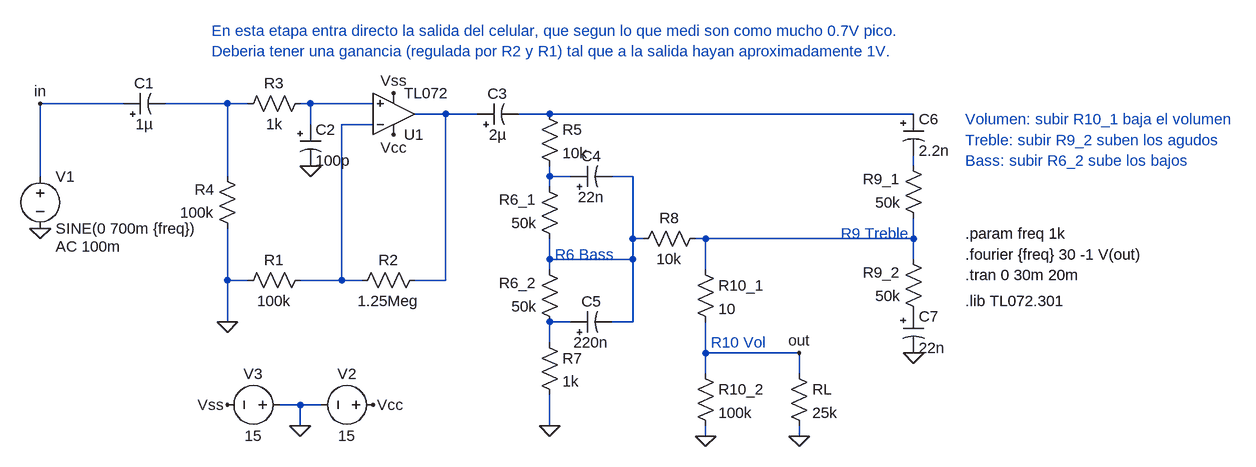
[diagram p0: schematic tone_control.asc]
tone_control.asc, the LTspice schematic file:
Version 4
SHEET 1 2100 696
WIRE -48 96 -176 96
WIRE 112 96 16 96
WIRE 144 96 112 96
WIRE 240 96 224 96
WIRE 336 96 240 96
WIRE 448 112 400 112
WIRE 496 112 448 112
WIRE 608 112 560 112
WIRE 1168 112 608 112
WIRE 240 128 240 96
WIRE 336 128 288 128
WIRE 1168 192 1168 176
WIRE -176 208 -176 96
WIRE 112 208 112 96
WIRE 608 208 608 192
WIRE 640 208 608 208
WIRE 736 208 704 208
WIRE 608 224 608 208
WIRE 736 304 736 208
WIRE 752 304 736 304
WIRE 848 304 832 304
WIRE 1168 304 1168 272
WIRE 1168 304 848 304
WIRE 608 336 608 304
WIRE 736 336 736 304
WIRE 736 336 608 336
WIRE 1168 336 1168 304
WIRE 608 352 608 336
WIRE 848 352 848 304
WIRE 112 368 112 288
WIRE 144 368 112 368
WIRE 288 368 288 128
WIRE 288 368 224 368
WIRE 320 368 288 368
WIRE 448 368 448 112
WIRE 448 368 400 368
WIRE 112 432 112 368
WIRE 640 432 608 432
WIRE 736 432 736 336
WIRE 736 432 704 432
WIRE 608 464 608 432
WIRE 848 480 848 432
WIRE 992 480 848 480
WIRE 848 512 848 480
WIRE 992 512 992 480
WIRE 224 560 192 560
WIRE 256 560 224 560
WIRE 224 592 224 560
WIRE 608 592 608 544
WIRE 848 608 848 592
WIRE 992 608 992 592
FLAG -176 288 0
FLAG 608 592 0
FLAG 112 432 0
FLAG 992 608 0
FLAG 368 144 Vcc
FLAG 368 80 Vss
FLAG 240 192 0
FLAG 848 608 0
FLAG 1168 480 0
FLAG 992 480 out
FLAG -176 96 in
FLAG 224 592 0
FLAG 336 560 Vcc
FLAG 112 560 Vss
SYMBOL polcap -48 112 R270
WINDOW 0 32 32 VTop 2
WINDOW 3 0 32 VBottom 2
SYMATTR InstName C1
SYMATTR Value 1µ
SYMBOL polcap 224 128 R0
SYMATTR InstName C2
SYMATTR Value 100p
SYMBOL polcap 496 128 R270
WINDOW 0 32 32 VTop 2
WINDOW 3 0 32 VBottom 2
SYMATTR InstName C3
SYMATTR Value 2µ
SYMBOL polcap 640 224 R270
WINDOW 0 32 32 VTop 2
WINDOW 3 0 32 VBottom 2
SYMATTR InstName C4
SYMATTR Value 22n
SYMBOL polcap 640 448 R270
WINDOW 0 32 32 VTop 2
WINDOW 3 0 32 VBottom 2
SYMATTR InstName C5
SYMATTR Value 220n
SYMBOL polcap 1152 112 R0
SYMATTR InstName C6
SYMATTR Value 2.2n
SYMBOL polcap 1152 416 R0
SYMATTR InstName C7
SYMATTR Value 22n
SYMBOL res 240 80 R90
WINDOW 0 0 56 VBottom 2
WINDOW 3 32 56 VTop 2
SYMATTR InstName R3
SYMATTR Value 1k
SYMBOL res 128 304 R180
WINDOW 0 36 76 Left 2
WINDOW 3 36 40 Left 2
SYMATTR InstName R4
SYMATTR Value 100k
SYMBOL res 128 384 R270
WINDOW 0 32 56 VTop 2
WINDOW 3 0 56 VBottom 2
SYMATTR InstName R1
SYMATTR Value 100k
SYMBOL res 304 384 R270
WINDOW 0 32 56 VTop 2
WINDOW 3 0 56 VBottom 2
SYMATTR InstName R2
SYMATTR Value 1.25Meg
SYMBOL res 592 96 R0
SYMATTR InstName R5
SYMATTR Value 10k
SYMBOL res 624 448 R180
WINDOW 0 36 76 Left 2
WINDOW 3 36 40 Left 2
SYMATTR InstName R6_2
SYMATTR Value 50k
SYMBOL res 592 448 R0
SYMATTR InstName R7
SYMATTR Value 1k
SYMBOL res 848 288 R90
WINDOW 0 0 56 VBottom 2
WINDOW 3 32 56 VTop 2
SYMATTR InstName R8
SYMATTR Value 10k
SYMBOL res 1184 288 R180
WINDOW 0 36 76 Left 2
WINDOW 3 36 40 Left 2
SYMATTR InstName R9_1
SYMATTR Value 50k
SYMBOL res 832 336 R0
SYMATTR InstName R10_1
SYMATTR Value 10
SYMBOL res 976 496 R0
SYMATTR InstName RL
SYMATTR Value 25k
SYMBOL voltage -176 192 R0
WINDOW 123 24 124 Left 2
WINDOW 39 0 0 Left 0
SYMATTR Value2 AC 100m
SYMATTR InstName V1
SYMATTR Value SINE(0 700m {freq})
SYMBOL Opamps\\opamp2 368 176 M180
SYMATTR InstName U1
SYMATTR Value TL072
SYMBOL res 624 320 R180
WINDOW 0 36 76 Left 2
WINDOW 3 36 40 Left 2
SYMATTR InstName R6_1
SYMATTR Value 50k
SYMBOL res 1184 432 R180
WINDOW 0 36 76 Left 2
WINDOW 3 36 40 Left 2
SYMATTR InstName R9_2
SYMATTR Value 50k
SYMBOL res 832 496 R0
SYMATTR InstName R10_2
SYMATTR Value 100k
SYMBOL voltage 352 560 R90
WINDOW 0 -32 56 VBottom 2
WINDOW 3 32 56 VTop 2
WINDOW 123 0 0 Left 0
WINDOW 39 0 0 Left 0
SYMATTR InstName V2
SYMATTR Value 15
SYMBOL voltage 208 560 R90
WINDOW 0 -32 56 VBottom 2
WINDOW 3 32 56 VTop 2
WINDOW 123 0 0 Left 0
WINDOW 39 0 0 Left 0
SYMATTR InstName V3
SYMATTR Value 15
TEXT 616 328 Left 2 ;R6 Bass
TEXT 856 464 Left 2 ;R10 Vol
TEXT 1056 296 Left 2 ;R9 Treble
TEXT 1248 400 Left 2 !.lib TL072.301
TEXT 1248 360 Left 2 !.tran 0 30m 20m
TEXT 1248 120 Left 2 ;Volumen: subir R10_1 baja el volumen
TEXT 88 -16 Left 2 ;En esta etapa entra directo la salida del celular, que segun lo que medi son como mucho 0.7V pico.\nDeberia tener una ganancia (regulada por R2 y R1) tal que a la salida hayan aproximadamente 1V.
TEXT 1248 152 Left 2 ;Treble: subir R9_2 suben los agudos
TEXT 1248 184 Left 2 ;Bass: subir R6_2 sube los bajos
TEXT 1248 328 Left 2 !.fourier {freq} 30 -1 V(out)
TEXT 1248 296 Left 2 !.param freq 1k

The netlist it stands for:
* tone_control.asc
C1 in N001 1µ
C2 N002 0 100p
C3 N003 N004 2µ
C4 N007 N008 22n
C5 N010 N008 220n
C6 N004 N006 2.2n
C7 P001 0 22n
R3 N002 N001 1k
R4 0 N001 100k
R1 0 N005 100k
R2 N005 N003 1.25Meg
R5 N004 N007 10k
R6_2 N010 N008 50k
R7 N010 0 1k
R8 N009 N008 10k
R9_1 N009 N006 50k
R10_1 N009 out 10
RL out 0 25k
V1 in 0 SINE(0 700m {freq}) AC 100m
XU1 N002 N005 Vcc Vss N003 TL072  ; pins In+ In- V+ V- OUT
R6_1 N008 N007 50k
R9_2 P001 N009 50k
R10_2 out 0 100k
V2 Vcc 0 15
V3 0 Vss 15
* R6 Bass
* R10 Vol
* R9 Treble
.lib TL072.301
.tran 0 30m 20m
* Volumen: subir R10_1 baja el volumen
* En esta etapa entra directo la salida del celular, que segun lo que medi son como mucho 0.7V pico.
* Deberia tener una ganancia (regulada por R2 y R1) tal que a la salida hayan aproximadamente 1V.
* Treble: subir R9_2 suben los agudos
* Bass: subir R6_2 sube los bajos
.fourier {freq} 30 -1 V(out)
.param freq 1k
.backanno
.end